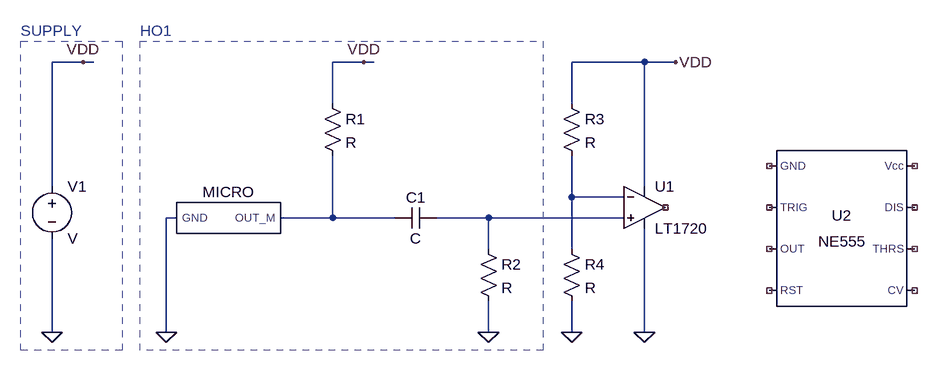
[diagram p0: schematic Circuit.asc]
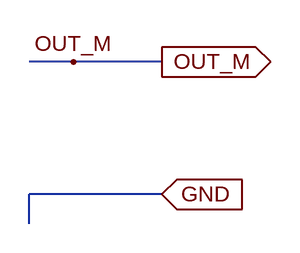
[diagram p1: sub-circuit micro.asc]
Circuit.asc, the LTspice schematic file:
Version 4
SHEET 1 1284 680
WIRE -144 96 -192 96
WIRE -128 96 -144 96
WIRE 288 96 240 96
WIRE 304 96 288 96
WIRE 720 96 608 96
WIRE 768 96 720 96
WIRE 240 160 240 96
WIRE 608 160 608 96
WIRE -192 288 -192 96
WIRE 720 288 720 96
WIRE 608 304 608 240
WIRE 688 304 608 304
WIRE 0 336 -16 336
WIRE 240 336 240 240
WIRE 240 336 160 336
WIRE 336 336 240 336
WIRE 480 336 400 336
WIRE 688 336 480 336
WIRE 480 384 480 336
WIRE 608 384 608 304
WIRE -192 512 -192 368
WIRE -16 512 -16 336
WIRE 480 512 480 464
WIRE 608 512 608 464
WIRE 720 512 720 352
FLAG 288 96 VDD
FLAG 480 512 0
FLAG -16 512 0
FLAG 720 512 0
FLAG 768 96 VDD
FLAG 608 512 0
FLAG -192 512 0
FLAG -144 96 VDD
SYMBOL micro 80 336 R0
SYMATTR InstName MICRO
SYMBOL res 224 144 R0
SYMATTR InstName R1
SYMBOL cap 400 320 R90
WINDOW 0 0 32 VBottom 2
WINDOW 3 32 32 VTop 2
SYMATTR InstName C1
SYMBOL res 464 368 R0
SYMATTR InstName R2
SYMBOL Comparators/LT1720 720 256 R0
SYMATTR InstName U1
SYMBOL res 592 144 R0
SYMATTR InstName R3
SYMBOL res 592 368 R0
SYMATTR InstName R4
SYMBOL Misc/NE555 1024 352 R0
SYMATTR InstName U2
SYMBOL voltage -192 272 R0
SYMATTR InstName V1
TEXT -240 48 Left 2 ;SUPPLY
TEXT -56 48 Left 2 ;HO1
RECTANGLE Normal -240 64 -84 540 2
RECTANGLE Normal -56 64 564 540 2

micro.asc, the sub-circuit schematic file:
Version 4
SHEET 1 880 680
WIRE 448 256 400 256
WIRE 544 256 448 256
WIRE 544 400 400 400
WIRE 400 432 400 400
FLAG 448 256 OUT_M
FLAG 544 256 OUT_M
IOPIN 544 256 Out
FLAG 544 400 GND
IOPIN 544 400 In

The netlist it stands for:
* Circuit.asc
XMICRO 0 N002 micro
R1 VDD N002 R
C1 N003 N002 C
R2 N003 0 R
XU1 N003 N001 VDD 0 NC_01 LT1720  ; pins In+ In- V+ V- OUT
R3 VDD N001 R
R4 N001 0 R
XU2 NC_02 NC_03 NC_04 NC_05 NC_06 NC_07 NC_08 NC_09 NE555  ; pins GND TRIG OUT RST CV THRS DIS Vcc
V1 VDD 0 V

* block symbol definitions
.subckt micro GND OUT_M
.ends micro

* SUPPLY
* HO1
.lib LT1720.sub
.lib NE555.sub
.backanno
.end